# Altium schematic sheet PowerSupply.SchDoc
size A4
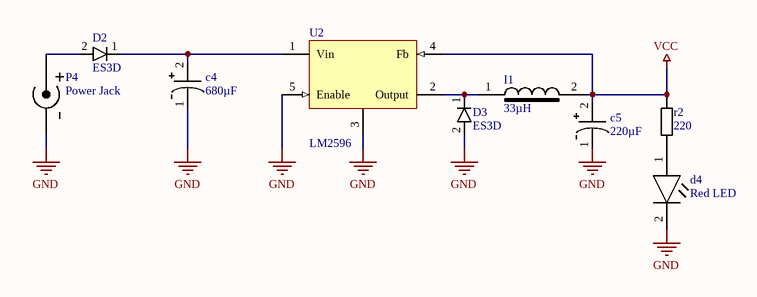
[diagram p0: PowerSupply.SchDoc]

## Parts
c4  680µF  [Elco-C]
c5  220µF  [Elco-C]
D2  ES3D  [DO-214AB (SMC)]
D3  ES3D  [DO-214AB (SMC)]
d4  Red LED  [0805 - diode]
I1  33µH  [DR125]
P4  Power Jack  [Power Jack]
r2  220  [0603]
U2  LM2596  [TO-263-5]

## Nets
GND: c4.1 c5.1 D3.2 d4.2 P4.2(GND) U2.3(GND) U2.5(Enable) U2.6
VCC: c5.2 I1.2 r2.2 U2.4(Fb)
Netc4_2: c4.2 D2.1 U2.1(Vin)
NetD2_2: D2.2 P4.1(V+)
NetD3_1: D3.1 I1.1 U2.2(Output)
Netd4_1: d4.1 r2.1

## Library data of the parts
c4 c5 = Elco G
D2 D3 = ES3D: ES3D diode
d4 = Red LED: Red diffused LED
I1 = Inductor: Inductor with Ferrite core
r2 = 0603 Resistor: ...R
U2 = LM2596: LM2596 Switching Voltage Regulator